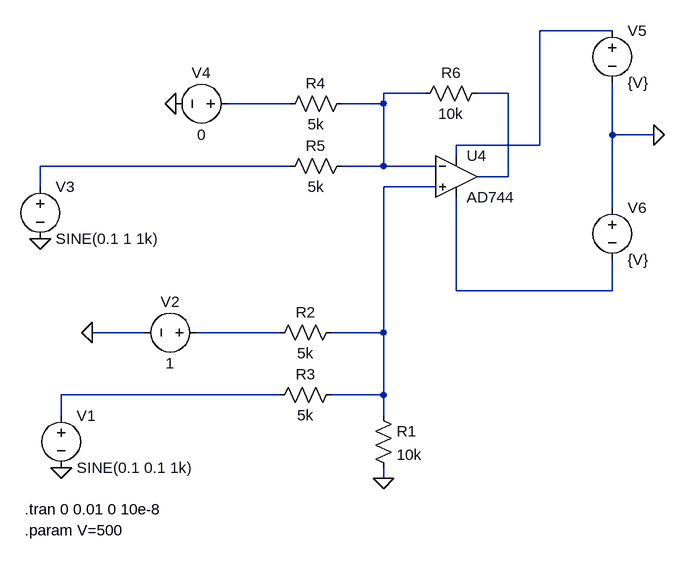
[diagram p0: schematic Draft8.asc]
Draft8.asc, the LTspice schematic file:
Version 4.1
SHEET 1 996 768
WIRE 496 -64 384 -64
WIRE 208 32 144 32
WIRE 336 32 288 32
WIRE 0 48 -96 48
WIRE 144 48 144 32
WIRE 144 48 80 48
WIRE 496 96 496 16
WIRE 560 96 496 96
WIRE 384 112 384 -64
WIRE 384 112 256 112
WIRE 256 128 256 112
WIRE 0 144 -384 144
WIRE 144 144 144 48
WIRE 144 144 80 144
WIRE 224 144 144 144
WIRE 336 160 336 32
WIRE 336 160 288 160
WIRE -384 176 -384 144
WIRE 224 176 144 176
WIRE 496 208 496 96
WIRE 256 336 256 192
WIRE 496 336 496 288
WIRE 496 336 256 336
WIRE -224 400 -304 400
WIRE -16 400 -144 400
WIRE 144 400 144 176
WIRE 144 400 64 400
WIRE -16 496 -352 496
WIRE 144 496 144 400
WIRE 144 496 64 496
WIRE -352 528 -352 496
WIRE 144 528 144 496
WIRE 144 624 144 608
FLAG 144 624 0
FLAG -352 608 0
FLAG -304 400 0
FLAG -384 256 0
FLAG -176 48 0
FLAG 560 96 0
SYMBOL res 128 512 R0
SYMATTR InstName R1
SYMATTR Value 10k
SYMBOL voltage -352 512 R0
SYMATTR InstName V1
SYMATTR Value SINE(0.1 0.1 1k)
SYMBOL voltage -128 400 R90
WINDOW 0 -32 56 VBottom 2
WINDOW 3 32 56 VTop 2
SYMATTR InstName V2
SYMATTR Value 1
SYMBOL res 80 384 R90
WINDOW 0 0 56 VBottom 2
WINDOW 3 32 56 VTop 2
SYMATTR InstName R2
SYMATTR Value 5k
SYMBOL res 80 480 R90
WINDOW 0 0 56 VBottom 2
WINDOW 3 32 56 VTop 2
SYMATTR InstName R3
SYMATTR Value 5k
SYMBOL voltage -384 160 R0
SYMATTR InstName V3
SYMATTR Value SINE(0.1 1 1k)
SYMBOL voltage -80 48 R90
WINDOW 0 -32 56 VBottom 2
WINDOW 3 32 56 VTop 2
SYMATTR InstName V4
SYMATTR Value 0
SYMBOL res 96 32 R90
WINDOW 0 0 56 VBottom 2
WINDOW 3 32 56 VTop 2
SYMATTR InstName R4
SYMATTR Value 5k
SYMBOL res 96 128 R90
WINDOW 0 0 56 VBottom 2
WINDOW 3 32 56 VTop 2
SYMATTR InstName R5
SYMATTR Value 5k
SYMBOL res 304 16 R90
WINDOW 0 0 56 VBottom 2
WINDOW 3 32 56 VTop 2
SYMATTR InstName R6
SYMATTR Value 10k
SYMBOL voltage 496 -80 R0
SYMATTR InstName V5
SYMATTR Value {V}
SYMBOL voltage 496 192 R0
SYMATTR InstName V6
SYMATTR Value {V}
SYMBOL OpAmps\\AD744 256 96 R0
SYMATTR InstName U4
TEXT -408 672 Left 2 !.tran 0 0.01 0 10e-8
TEXT -408 704 Left 2 !.param V=500

The netlist it stands for:
* Draft8.asc
R1 N006 0 10k
V1 N009 0 SINE(0.1 0.1 1k)
V2 N008 0 1
R2 N006 N008 5k
R3 N006 N009 5k
V3 N005 0 SINE(0.1 1 1k)
V4 N004 0 0
R4 N002 N004 5k
R5 N002 N005 5k
R6 N003 N002 10k
V5 N001 0 {V}
V6 0 N007 {V}
X§U4 N006 N002 N001 N007 N003 AD744  ; pins In+ In- V+ V- OUT
.tran 0 0.01 0 10e-8
.param V=500
.backanno
.end